# EAGLE board TD Toolboard V2 (EAGLE 9.6.2)
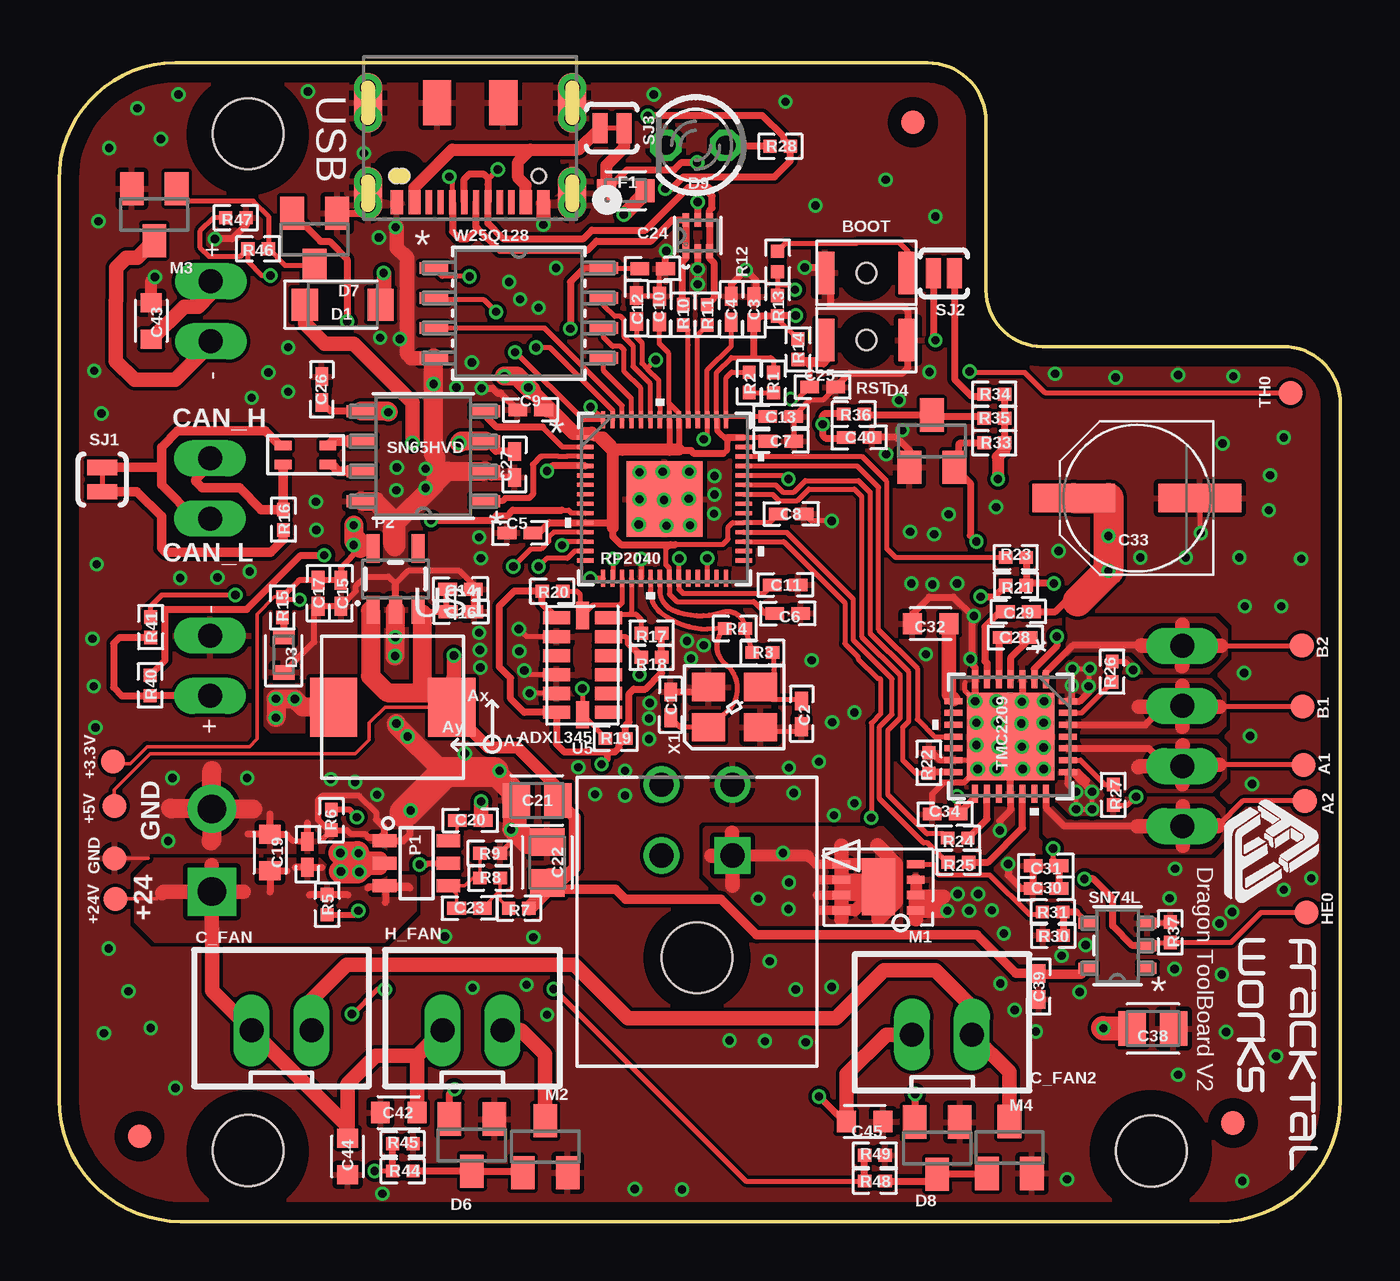
[diagram p2: board, top side]
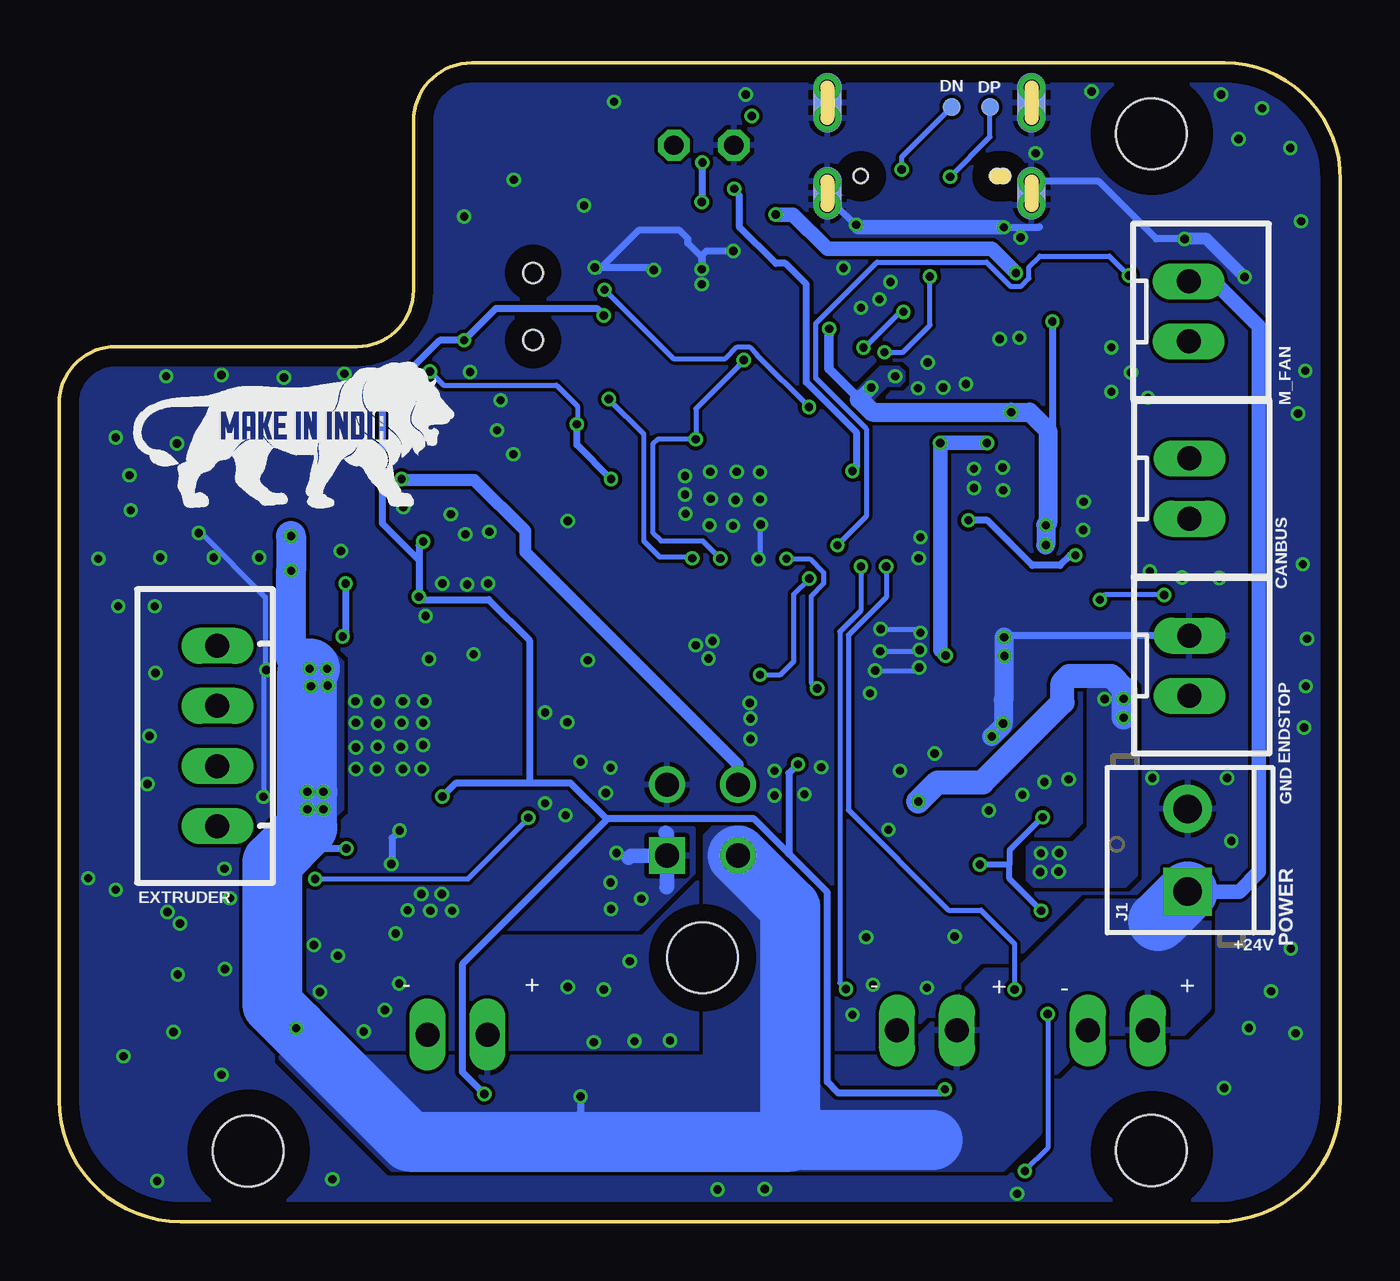
[diagram p3: board, bottom side, seen from below]

Size 54.2 x 49 mm. Coordinates in mm from the lower left corner, seen from the top.
Outline: 4.9,49 36.74,49 arc-90 39.21,46.53 39.21,39.38 arc90 41.59,37 51.8,37 arc-90 54.2,34.6 54.2,5.14 arc-90 49.06,0 5.15,0 arc-90 0,5.15 0,44.05 arc-90 4.9,49
Copper layers (1*16): Top 0.035mm / dielectric 1.5mm / Bottom 0.035mm
Design rules "LionCircuits *": minimum track width 6mil, minimum drill 0.35mm, track to track 6mil, track to pad 6mil, pad to pad 6mil, via to via 6mil, smd to smd 6mil, copper to edge 30mil, drill to drill 10mil, minimum pad ring 10mil, minimum via ring 5mil, stop-mask expansion 4mil, vias tented up to drill 0mil, thermal gap 8mil
Holes 3 mm at 8,46 8,3 46.2,2.99
tRestrict: area 5.5,43.5 to 10.5,48.5; area 43.7,0.5 to 48.7,5.5; area 5.5,0.5 to 10.5,5.5
bRestrict: area 5.5,43.5 to 10.5,48.5; area 5.5,0.4 to 10.5,5.4; area 43.7,0.5 to 48.7,5.5

## Footprints (pad centres in the part's own frame; a part is rotated, then mirrored left to right if it is on the bottom)
PAD.03X.04 = smd 1.016 x 1.016: P$1 0,0
B3U-1000P(M)-B = smd 0.8 x 1.8: 1 -1.75,0; 2 1.75,0 | hole 0.85: 0,0
CAPC1005X60 = smd 0.79 x 0.54: 1 -0.55,0; 2 0.545,0
CAPC1608X85 = smd 0.8 x 0.9: 1 -0.775,0; 2 0.775,0
CAPC2012X110 = smd 1.165 x 1.465: 1 -0.875,0; 2 0.875,0
PANASONIC_D = smd 3.5 x 1.2: + 2.67,0; - -2.67,0
JST-XH-02-PACKAGE-LONG-PAD = drill 1.016 long: 1 -1.27,0; 2 1.27,0
SODFL3718X115 = smd 1.115 x 1.361: 1 -1.6,0; 2 1.6,0
SOT-666_STM-L = smd 0.583 x 0.28: 1 -0.66,0.5; 2 -0.66,0; 3 -0.66,-0.5; 4 0.66,-0.5; 5 0.66,0; 6 0.66,0.5
LEDC1608X35N_FLAT-G = smd 0.612 x 0.912: A 0.75,0; C -0.75,0
SOT23 = smd 1 x 1.4: 1 -0.95,-1.1; 2 0.95,-1.1; 3 0,1.1
LED3MM = drill 0.813 octagon: A -1.27,0; K 1.27,0
JST-XH-04-PACKAGE-LONG-PAD = drill 1.016 long: 1 -3.81,0; 2 -1.27,0; 3 1.27,0; 4 3.81,0
FUSC1608X60N = smd 0.799 x 0.974: 1 -0.815,0; 2 0.815,0
FIDUCIAL_1MM = smd 1 x 1: 1 0,0
PAD.03X.03 = smd 0.762 x 0.762: P$1 0,0
SCREWTERMINAL-3.5MM-2 = drill 1.2 pad 2.032 square: 1 0,0 | drill 1.2 pad 2.032: 2 3.5,0
CON_430450400_MOL = drill 1.02 pad 1.52 square: 1 0,0 | drill 1.02 pad 1.52: 2 -3,0; 3 0,3; 4 -3,3 | hole 3: -1.5,-4.32
NMOSFET_WSD3066DN33 = smd 0.75 x 0.35: P$1 -1.575,1; P$2 -1.575,0.35; P$3 -1.575,-0.3; P$4 -1.575,-0.95; P$5 1.575,-0.95; P$6 1.575,-0.3; P$7 1.575,0.35; P$8 1.575,1 | smd 1.4 x 2.4: P$9 0,0
SOT-23-6 = smd 1 x 0.55: 1 -1.35,0.95; 2 -1.35,0; 3 -1.35,-0.95; 4 1.35,-0.95; 5 1.35,0; 6 1.35,0.95
SOT23-5 = smd 0.55 x 1.2: 1 -0.95,-1.3; 2 0,-1.3; 3 0.95,-1.3; 4 0.95,1.3; 5 -0.95,1.3
RESC1005X40 = smd 0.566 x 0.54: 1 -0.433,0; 2 0.433,0
SJ_2S-TRACE = smd 0.635 x 1.27: 1 -0.508,0; 2 0.508,0
SJ_2S-NO = smd 0.635 x 1.27: 1 -0.45,0; 2 0.45,0
IC57_RP2040-L = smd 0.708 x 0.179: 1 -3.351,2.6; 2 -3.351,2.2; 3 -3.351,1.8; 4 -3.351,1.4; 5 -3.351,1; 6 -3.351,0.6; 7 -3.351,0.2; 8 -3.351,-0.2; 9 -3.351,-0.6; 10 -3.351,-1; 11 -3.351,-1.4; 12 -3.351,-1.8; 13 -3.351,-2.2; 14 -3.351,-2.6; 29 3.351,-2.6; 30 3.351,-2.2; 31 3.351,-1.8; 32 3.351,-1.4; 33 3.351,-1; 34 3.351,-0.6; 35 3.351,-0.2; 36 3.351,0.2; 37 3.351,0.6; 38 3.351,1; 39 3.351,1.4; 40 3.351,1.8; 41 3.351,2.2; 42 3.351,2.6 | smd 0.179 x 0.708: 15 -2.6,-3.351; 16 -2.2,-3.351; 17 -1.8,-3.351; 18 -1.4,-3.351; 19 -1,-3.351; 20 -0.6,-3.351; 21 -0.2,-3.351; 22 0.2,-3.351; 23 0.6,-3.351; 24 1,-3.351; 25 1.4,-3.351; 26 1.8,-3.351; 27 2.2,-3.351; 28 2.6,-3.351; 43 2.6,3.351; 44 2.2,3.351; 45 1.8,3.351; 46 1.4,3.351; 47 1,3.351; 48 0.6,3.351; 49 0.2,3.351; 50 -0.2,3.351; 51 -0.6,3.351; 52 -1,3.351; 53 -1.4,3.351; 54 -1.8,3.351; 55 -2.2,3.351; 56 -2.6,3.351 | smd 3.2 x 3.2: 57 0,0
SOIC_128JVSIQ_WIN-L = smd 1.213 x 0.483: 1 -3.595,1.905; 2 -3.595,0.635; 3 -3.595,-0.635; 4 -3.595,-1.905; 5 3.595,-1.905; 6 3.595,-0.635; 7 3.595,0.635; 8 3.595,1.905
D8-L = smd 1.255 x 0.508: 1 -2.621,1.905; 2 -2.621,0.635; 3 -2.621,-0.635; 4 -2.621,-1.905; 5 2.621,-1.905; 6 2.621,-0.635; 7 2.621,0.635; 8 2.621,1.905
ADXL345_LGA14 = smd 1.145 x 0.55: 1 -1.097,2; 2 -1.097,1.2; 3 -1.097,0.4; 4 -1.097,-0.4; 5 -1.097,-1.2; 6 -1.097,-2; 8 1.097,-2; 9 1.097,-1.2; 10 1.097,-0.4; 11 1.097,0.4; 12 1.097,1.2; 13 1.097,2 | smd 0.55 x 1.145: 7 0,-2.098; 14 0,2.098
DBV5-L = smd 0.772 x 0.458: 1 -1.262,0.95; 2 -1.262,0; 3 -1.262,-0.95; 4 1.262,-0.95; 5 1.262,0.95
QFN28_5X5_3X8_EPAD_TRI = smd 0.757 x 0.255: 1 -2.423,1.5; 2 -2.423,1; 3 -2.423,0.5; 4 -2.423,0; 5 -2.423,-0.5; 6 -2.423,-1; 7 -2.423,-1.5; 15 2.423,-1.5; 16 2.423,-1; 17 2.423,-0.5; 18 2.423,0; 19 2.423,0.5; 20 2.423,1; 21 2.423,1.5 | smd 0.255 x 0.757: 8 -1.5,-2.423; 9 -1,-2.423; 10 -0.5,-2.423; 11 0,-2.423; 12 0.5,-2.423; 13 1,-2.423; 14 1.5,-2.423; 22 1.5,2.423; 23 1,2.423; 24 0.5,2.423; 25 0,2.423; 26 -0.5,2.423; 27 -1,2.423; 28 -1.5,2.423 | smd 3.7 x 3.7: 29 0,0
YSPI0530-150 = smd 2 x 2.5: 1 -2.5,0; 2 2.5,0
FDCW2012-2-201TF = smd 0.7 x 0.4: 1 -0.95,0.4; 2 -0.95,-0.4; 3 0.95,-0.4; 4 0.95,0.4
CONN12_KH-TYPE-C-16P = smd 0.52 x 1: 1 -3.1,1.1; 2 -2.35,1.1; 11 2.35,1.1; 12 3.1,1.1 | smd 0.27 x 1: 3 -1.75,1.1; 4 -1.25,1.1; 5 -0.75,1.1; 6 -0.25,1.1; 7 0.25,1.1; 8 0.75,1.1; 9 1.25,1.1; 10 1.75,1.1 | smd 1.2 x 2.2: 13 -4.32,0.725; 14 4.32,0.725 | smd 1.2 x 2.5: 15 -4.32,-3.1; 16 4.32,-3.1 | smd 1.2 x 1.9: 18 -1.4,-3.1; 19 1.4,-3.1 | drill 0.65 pad 0.65: 20 -4.32,1.225; 21 -4.32,0.225; 24 4.32,1.225; 25 4.32,0.225; 26 4.32,-2.45; 27 4.32,-3.75; 28 -4.32,-2.45; 29 -4.32,-3.75 | smd 1.2 x 2.5 bottom: 37 -4.32,-3.1; 41 4.32,-3.1 | smd 1.2 x 2.2 bottom: 39 -4.32,0.725; 43 4.32,0.725 | hole 0.6: -2.9,0; 3.125,0; 2.875,0
CRYSTAL_3225 = smd 1.4 x 1.2: P$1 -1.1,-0.85; P$2 1.1,-0.85; P$3 1.1,0.85; P$4 -1.1,0.85

## Placement (x,y rotation side)
3.3V  TEST-POINT3X4  [PAD.03X.04]  2.29,19.45 90 top
5V  TEST-POINT3X4  [PAD.03X.04]  2.34,17.58 90 top
24V  TEST-POINT3X4  [PAD.03X.04]  2.37,13.65 90 top
A1  TEST-POINT3X4  [PAD.03X.04]  52.64,19.31 90 top
A2  TEST-POINT3X4  [PAD.03X.04]  52.69,17.79 90 top
B1  TEST-POINT3X4  [PAD.03X.04]  52.59,21.78 90 top
B2  TEST-POINT3X4  [PAD.03X.04]  52.57,24.37 90 top
BOOT  B3U-1000P(M)-B  [B3U-1000P(M)-B]  34.15,40.12 0 top
C1  30pF  [CAPC1005X60]  25.87,21.85 90 top
C2  30pF  [CAPC1005X60]  31.41,21.47 90 top
C3  1uF  [CAPC1005X60]  29.4,38.57 90 top
C4  1uF  [CAPC1005X60]  28.44,38.58 90 top
C5  100nF  [CAPC1005X60]  19.49,29.12 180 top
C6  100nF  [CAPC1005X60]  30.82,25.71 0 top
C7  100nF  [CAPC1005X60]  30.53,33 0 top
C8  100nF  [CAPC1005X60]  30.97,29.92 0 top
C9  100nF  [CAPC1005X60]  19.94,34.32 180 top
C10  100nF  [CAPC1005X60]  25.39,38.59 90 top
C11  100nF  [CAPC1005X60]  30.72,26.92 0 top
C12  100nF  [CAPC1005X60]  24.42,38.61 90 top
C13  1uF  [CAPC1005X60]  30.53,34.04 0 top
C14  1uF  [CAPC1005X60]  16.98,26.74 0 top
C15  1uF  [CAPC1005X60]  11.92,26.57 270 top
C16  100nF  [CAPC1005X60]  17,25.79 0 top
C17  100nF  [CAPC1005X60]  10.96,26.57 270 top
C18  100nF  [CAPC1005X60]  10.5,15.53 90 top
C19  10uF  [CAPC1608X85]  8.92,15.6 90 top
C20  100nF  [CAPC1005X60]  17.39,16.96 0 top
C21  22uF  [CAPC2012X110]  20.21,17.81 180 top
C22  22uF  [CAPC2012X110]  20.65,15.18 90 top
C23  75pF  [CAPC1005X60]  17.36,13.25 180 top
C24  100nF  [CAPC1005X60]  25.11,40.29 0 top
C25  100nF  [CAPC1005X60]  32.3,35.29 180 top
C26  100nF  [CAPC1005X60]  11.11,35.19 90 top
C27  100nF  [CAPC1005X60]  19.27,32.01 270 top
C28  22nF  [CAPC1005X60]  40.45,24.7 0 top
C29  100nF  [CAPC1005X60]  40.58,25.79 180 top
C30  100nF  [CAPC1005X60]  41.75,14.08 0 top
C31  100nF  [CAPC1005X60]  41.75,15.05 0 top
C32  4.7uF  [CAPC1608X85]  36.87,25.28 0 top
C33  100uF  [PANASONIC_D]  45.58,30.59 180 top
C34  100nF  [CAPC1005X60]  37.48,17.23 180 top
C38  22uF  [CAPC2012X110]  46.27,8.16 0 top
C39  100nF  [CAPC1005X60]  41.44,9.94 270 top
C40  100nF  [CAPC1005X60]  33.85,33.16 0 top
C42  4.7uF  [CAPC1608X85]  14.36,4.61 180 top
C43  4.7uF  [CAPC1608X85]  3.9,38.08 90 top
C44  4.7uF  [CAPC1608X85]  12.21,2.75 270 top
C45  4.7uF  [CAPC1608X85]  34.08,4.23 0 top
C_FAN  JST-XH-02-PIN-LONG-PAD  [JST-XH-02-PACKAGE-LONG-PAD]  9.41,8.09 0 top
C_FAN2  JST-XH  [JST-XH-02-PACKAGE-LONG-PAD]  37.35,7.91 0 top
CANBUS  JST-XH-02-PIN-LONG-PAD  [JST-XH-02-PACKAGE-LONG-PAD]  6.39,31 270 bottom
D1  MBR0520LT1G  [SODFL3718X115]  12,38.77 0 top
D2  USBLC6-2P6SOT-666_STM-L  [SOT-666_STM-L]  27.01,41.69 90 top
D3  LED_G  [LEDC1608X35N_FLAT-G]  9.5,23.97 90 top
D4  BAT54S  [SOT23]  36.92,33 0 top
D6  BAT54S  [SOT23]  17.46,3.24 180 top
D7  BAT54S  [SOT23]  10.81,41.54 180 top
D8  BAT54S  [SOT23]  37.15,3.11 180 top
D9  LED_G  [LED3MM]  26.93,45.51 180 top
ENDSTOP  JST-XH-02-PIN-LONG-PAD  [JST-XH-02-PACKAGE-LONG-PAD]  6.39,23.5 270 bottom
EXTRUDER  JST-XH-04-PIN-LONG-PAD  [JST-XH-04-PACKAGE-LONG-PAD]  47.51,20.53 90 bottom
F1  FUSE_CHIP-0603(1608-METRIC)  [FUSC1608X60N]  23.97,43.6 180 top
FD4  FIDUCIAL  [FIDUCIAL_1MM]  49.66,4.17 0 top
FD5  FIDUCIAL  [FIDUCIAL_1MM]  3.4,3.61 0 top
FD6  FIDUCIAL  [FIDUCIAL_1MM]  36.12,46.48 0 top
GND  TEST-POINT3X4  [PAD.03X.04]  2.34,15.35 0 top
H_FAN  JST-XH-02-PIN-LONG-PAD  [JST-XH-02-PACKAGE-LONG-PAD]  17.49,8.09 0 top
HE0  TEST-POINT3X4  [PAD.03X.04]  52.77,13.07 0 top
IO1  TEST-POINT3  [PAD.03X.03]  16.45,47.13 0 bottom
IO2  TEST-POINT3  [PAD.03X.03]  14.82,47.13 0 bottom
J1  [SCREWTERMINAL-3.5MM-2]  6.46,13.95 90 bottom
J3  JST-MICROFIT  [CON_430450400_MOL]  28.49,15.48 0 top
M1  NMOSFET_WSD3066DN33  [NMOSFET_WSD3066DN33]  34.66,14.16 180 top
M2  CJ3400  [SOT23]  20.56,3.16 0 top
M3  CJ3400  [SOT23]  4.03,42.58 180 top
M4  CJ3400  [SOT23]  40.2,3.13 0 top
M_FAN  JST-XH-02-PIN-LONG-PAD  [JST-XH-02-PACKAGE-LONG-PAD]  6.41,38.49 270 bottom
P1  TPS54202_BUCKCONV  [SOT-23-6]  15.12,15.15 0 top
P2  3.3V  [SOT23-5]  14.23,27.17 0 top
R1  200R  [RESC1005X40]  30.22,35.48 90 top
R2  1R  [RESC1005X40]  29.19,35.48 270 top
R3  1K  [RESC1005X40]  29.76,24.06 180 top
R4  NO-FIT  [RESC1005X40]  28.59,25.08 180 top
R5  511k  [RESC1005X40]  11.34,13.41 90 top
R6  105k  [RESC1005X40]  11.52,16.98 90 top
R7  49.9R  [RESC1005X40]  19.44,13.25 0 top
R8  100k  [RESC1005X40]  18.23,14.52 0 top
R9  13.3k  [RESC1005X40]  18.22,15.58 180 top
R10  27.4R  [RESC1005X40]  26.4,38.34 270 top
R11  27.4R  [RESC1005X40]  27.42,38.34 270 top
R12  1K  [RESC1005X40]  30.39,40.6 90 top
R13  DO NOT FIT (10K)  [RESC1005X40]  30.39,38.72 270 top
R14  100k  [RESC1005X40]  31.26,36.89 90 top
R15  49.9R  [RESC1005X40]  9.44,25.98 90 top
R16  120R  [RESC1005X40]  9.49,29.68 270 top
R17  4.7K  [RESC1005X40]  25.06,24.88 0 top
R18  4.7K  [RESC1005X40]  25.06,23.86 0 top
R19  4.7K  [RESC1005X40]  23.53,20.43 0 top
R20  4.7K  [RESC1005X40]  20.87,26.65 180 top
R21  10K  [RESC1005X40]  40.48,26.91 0 top
R22  10K  [RESC1005X40]  36.79,19.39 270 top
R23  1K  [RESC1005X40]  40.48,28.08 180 top
R24  1K  [RESC1005X40]  38.01,16.21 0 top
R25  1K  [RESC1005X40]  38.04,15.2 0 top
R26  220mΩ  [RESC1005X40]  44.54,23.25 270 top
R27  220mΩ  [RESC1005X40]  44.59,18.04 90 top
R28  49.9R  [RESC1005X40]  30.5,45.47 0 top
R30  20K  [RESC1005X40]  42.05,12.1 0 top
R31  27.4R  [RESC1005X40]  42.03,13.09 0 top
R33  4.7K  [RESC1005X40]  39.56,32.93 180 top
R34  4.12K  [RESC1005X40]  39.56,34.99 180 top
R35  2.37K  [RESC1005X40]  39.56,33.97 180 top
R36  2.37K  [RESC1005X40]  33.62,34.15 180 top
R37  10K  [RESC1005X40]  47,12.23 270 top
R40  1K  [RESC1005X40]  3.85,22.67 270 top
R41  10K  [RESC1005X40]  3.87,25.13 270 top
R44  27.4R  [RESC1005X40]  14.54,2.14 180 top
R45  20K  [RESC1005X40]  14.54,3.29 180 top
R46  27.4R  [RESC1005X40]  8.42,41.13 180 top
R47  20K  [RESC1005X40]  7.48,42.45 180 top
R48  27.4R  [RESC1005X40]  34.51,1.71 180 top
R49  20K  [RESC1005X40]  34.51,2.8 180 top
RST  B3U-1000P(M)-B  [B3U-1000P(M)-B]  34.15,37.27 180 top
SJ1  SOLDERJUMPERTRACE  [SJ_2S-TRACE]  1.82,31.38 270 top
SJ2  SOLDERJUMPERNO  [SJ_2S-NO]  37.43,40.09 180 top
SJ3  SOLDERJUMPERTRACE  [SJ_2S-TRACE]  23.38,46.24 180 top
TH0  TEST-POINT3X4  [PAD.03X.04]  52.08,35.04 0 top
U1  RP2040  [IC57_RP2040-L]  25.61,30.55 0 top
U2  W25Q128  [SOIC_128JVSIQ_WIN-L]  19.44,38.41 0 top
U3  SN65HVD  [D8-L]  15.41,32.37 180 top
U5  ADXL345  [ADXL345_LGA14]  22.14,23.53 0 top
U6  SN74L  [DBV5-L]  44.77,11.67 180 top
U7  TMC2209  [QFN28_5X5_3X8_EPAD_TRI]  40.25,20.51 270 top
U$1  YSPI0530-150  [YSPI0530-150]  14.11,21.75 0 top
U$2  [MAKEININDIA]  50.08,29.47 0 bottom
U$3  [FWLOGO_SMALL]  48.15,18.04 270 top
U$4  FDCW2012-2-201TF  [FDCW2012-2-201TF]  10.43,32.42 180 top
USB  USB-C(KH-TYPE-C-16P)  [CONN12_KH-TYPE-C-16P]  17.39,44.21 180 top
X1  CRYSTAL_TAXM12M4RLBDDT2T_3225  [CRYSTAL_3225]  28.56,21.75 0 top

## Tracks (layer width: path | path; a pad name or v marks a point on that pad's centre or on a via)
+1.1V  (via drill 0.35)
  Top 0.203: U1.50 25.41,34.48 25.37,34.52 25.37,35.57 24.87,36.07 | C12.1 24.42,37.39 24.65,37.16 24.65,36.29 24.87,36.07 | C4.1 28.44,37.03 27.41,36.01 U1.45 27.41,33.23 v27.27,33.08 | v26.23,28.03 26.21,28.02 U1.23 26.22,26.73 26.38,26.57 29.82,26.57 C11.1 | 24.87,36.07 v25.24,36.43
  Bottom 0.203: v25.24,36.43 25.24,36.41 27.27,34.38 v27.27,33.08 28.89,33.08 29.07,32.9 29.07,29.11 28.74,28.78 26.98,28.78 v26.23,28.03
+3.3V  (via drill 0.35)
  Top 0.152: 3.3V.P$1 2.37,19.36 3,19.36 3.72,20.08 8.06,20.08 8.39,20.41 8.39,25.69 9.11,26.41 R15.2
  Top 0.203: C24.1 23.06,40.29 U2.8 | C7.1 29.83,33.15 U1.42 | C8.1 30.05,29.55 U1.33 28.49,29.55 28.3,29.37 28.3,28.86 28.08,28.64 28.07,28.65 26.09,28.65 26.07,28.63 | U1.49 25.79,33.92 25.79,34.6 | U1.44 27.81,35.91 28.44,36.53 29.4,36.53 30.11,36.53 30.22,36.43 R1.2 | C10.1 25.39,37.12 25.79,36.71 25.79,34.6 | U1.48 26.21,34.18 25.79,34.6 | 25.86,28.63 25.66,28.42 25.66,27.79 25.81,27.63 U1.22 25.81,26.53 26.13,26.21 29.38,26.21 29.83,25.76 29.83,25.71 C6.1 | R13.2 30.39,38.19 R14.2 | U1.1 22.88,33.15 22.89,33.14 | 22.9,33.14 22.9,33.13 23.38,32.65 | R41.1 3.87,26.02 4.35,26.5 v7.46,26.5 | v10.17,26.3 9.55,26.3 R15.2
  Top 0.254: P2.5 12.74,28.47 11.92,27.65 C15.1 C17.1 10.15,27.12 R15.2 | 28.09,32.47 28.26,32.64 28.26,33.15 | 23.82,32.5 23.08,33.24 | U1.44 27.83,33.88 27.83,33.45 28.29,32.99 28.29,33.15 | U1.49 25.81,32.57 | U1.48 26.21,32.65 26.21,32.51
  Top 0.305: U3.5 11.48,34.27 C26.1 | U2.8 22.21,40.32 21.63,39.74 v21.63,37.75 | C5.1 20.29,29.12 20.73,29.55 U1.10 23.23,29.55 23.42,29.36 23.42,28.97 23.76,28.63 25.86,28.63 26.07,28.63 | U7.15 38.75,17.95 C34.1 38.03,17.97 v37.99,17.97 | 23.42,32.62 23.42,32.9 23.08,33.24 22.8,33.24 22.78,33.26 21.96,33.26 | 28.09,32.47 26.86,32.47 26.73,32.6 25.84,32.6 | 23.18,19.86 21.37,19.86 21.04,20.18 U5.6 19.68,21.53 19.1,22.11 19.1,22.97 18.63,23.44 18.63,26.03 19.26,26.65 R20.2 20.43,26.14 U5.1 | 23.18,19.86 23.51,19.86 23.69,20.03 23.69,20.15 R19.2 23.97,20.98 24.11,21.13 24.11,22.33 24.3,22.52 24.8,22.52 25.49,23.21 R18.2 R17.2 | v22.95,19.34 23.18,19.57 23.18,19.86 | v38.98,26.43 39.56,26.43 R21.1 | v31.15,38.31 30.42,38.31 R13.2 29.66,38.29 C3.1 29.4,36.53 | SJ2.2 36.98,37.36 v37.07,37.26 | R33.2 38.11,32.93 38.06,32.88 38.06,32.1 D4.2 38.55,31.23 38.55,29.02 v38.8,28.76 | D7.2 11.05,41.44 11.43,41.44 12.18,40.7 v12.18,38.06 | v36.21,5.39 36.2,5.38 D8.2 | D6.2 16.51,5.38 v16.73,5.6 | 28.26,33.15 28.29,33.15 U1.42
  Top 0.406: P2.5 12.46,29.29 v12.46,29.45 | 19.97,35.15 20.79,34.32 20.9,34.32 21.96,33.26 21.88,33.26 20.94,34.2 20.61,34.2 C9.1 | 25.84,32.6 25.81,32.57
  Top 0.508: 21.93,33.36 22.54,33.36 22.65,33.25 | 26.21,32.65 23.38,32.65 22.89,33.14 22.9,33.14 23.42,32.62 23.42,29.36
  Top 0.61: v19.85,35.26 21.75,33.36 21.93,33.36
  Top 0.813: v13.93,34.22 13.88,34.27 U3.5 | v12.46,29.45 12.46,28.75 12.74,28.47 | v18.83,35.75 19.37,35.75 v19.85,35.26 19.97,35.15
  Bottom 0.203: v7.46,26.5 9.97,26.5 v10.17,26.3
  Bottom 0.254: 37.41,18.56 34.31,18.56
  Bottom 0.305: v22.95,19.34 23.33,18.96 23.33,15.55 | 31.03,17 30.98,17.05 24.83,17.05 23.33,15.55 | 34.31,18.56 34.31,24.58 36.03,26.3 38.85,26.3 v38.98,26.43 38.98,27.97 | 38.98,27.97 40.53,29.52 40.53,34.83 38.09,37.26 v37.07,37.26 35.73,38.61 31.45,38.61 v31.15,38.31 | 38.98,27.97 38.98,28.58 v38.8,28.76 | v12.18,38.06 12.18,33.66 12.38,33.46 | v37.99,17.97 37.41,18.56 32.58,18.56 31.03,17 | v36.21,5.39 37.15,6.33 37.15,10.88 31.03,17 | v16.73,5.6 16.88,5.45 21.25,5.45 21.7,5.9 21.7,13.92 23.33,15.55
  Bottom 0.406: v21.63,37.75 21.63,36.05 20.35,34.77
  Bottom 0.61: 20.35,34.77 v19.85,35.26
  Bottom 0.813: v12.46,28.61 v12.46,29.45 12.38,29.52 12.38,33.46 13.15,34.22 v13.93,34.22 19.8,34.22 20.35,34.77
  pour Bottom: 18.71,36.15 19.47,36.15 20.49,35.14 19.98,34.63 19.93,34.63 19.88,34.63 19.17,35.34 18.63,35.34 18.45,35.52 18.43,35.54 18.43,35.93 18.66,36.15
+5V  (via drill 0.35)
  Top 0.152: 5V.P$1 2.34,18.27 3.84,19.77 12.51,19.77 13.12,20.38 13.12,21.09 13.78,21.75 U$1.2
  Top 0.203: P2.3 15.36,25.69
  Top 0.254: 15.26,25.79 C16.1 16.37,25.87 16.37,26.67 C14.1 | P2.1 13.25,25.84 13.18,25.84
  Top 0.305: C27.1 18.47,32.56 U3.3 | P2.3 15.26,25.79
  Top 0.406: U6.5 43.25,10.46 41.47,10.46 C39.1 40.46,10.49 38.83,12.13 29.51,12.13 28.01,13.62 23.97,13.62 23.53,14.06 20.68,14.06 20.65,14.02
  Top 0.508: 20.78,14.44 21.27,14.44 21.81,14.97 21.81,17.09 C21.1 21.09,18.34 19.37,20.05 18.15,20.05 16.61,21.59 | U$1.2 16.61,22.36 16.61,22.96 16.7,23.05
  Top 0.61: R7.2 20.65,14.02 C22.1 | 15.36,22.59 15.13,22.36 15.1,22.34 | v16.7,23.94 16.7,23.05 16.7,22.74 | v14.95,32.93 14.95,34.63 12.46,37.12 11.24,37.12 10.4,37.96 D1.1
  Top 0.813: 13.18,25.84 13.18,23.07 13.88,22.36 15.13,22.36 16.61,22.36 | 15.36,25.69 15.36,22.59 | U3.3 17.01,33 v16.93,32.93 | U$1.2 16.61,21.59 | 16.61,22.65 16.7,22.74
  Top 1.016: 20.78,14.44 C22.1
  Bottom 0.61: v16.7,23.94 16.93,24.16 v16.93,32.93 v14.95,32.93
+24V  (via drill 0.35)
  Top 0.152: 24V.P$1 4.12,13.65 4.35,13.88
  Top 0.203: v43.02,18.17 v43.02,17.43 v43.7,17.43 v43.7,18.17 | v43.55,22.64 43.55,23.33 v43.6,23.38 v42.86,23.38 42.86,22.69 v42.84,22.67 | 42.05,15.29 v42.05,15.77
  Top 0.305: P1.3 14.75,14.2 14.84,14.11 13.85,14.11 P1.3 | P1.3 13.8,14.16 13.8,13.48 | P1.3 13.72,14.15 13.1,14.15 13.06,14.1 | 12.21,13.81 12.18,13.84 R5.2 11.32,13.82 10.59,13.82 | 10,14.98 C18.1 11.12,14.98 | C19.1 8.89,14.79 | C19.1 8.92,13.93 | C19.1 9.64,14.83 | v43.55,22.64 43.55,22.38 43.18,22.01 U7.28 42.84,22.17 v42.84,22.67 | 43.46,18.65 43.1,19.01 42.91,19.01 | 42.91,19.01 U7.22 42.67,18.52 v43.02,18.17 | v43.7,18.17 42.91,18.96 42.91,19.01 | C45.1 33.21,4.23 v32.14,5.29 | C29.1 42.15,25.79 43.09,26.73 | 43.09,26.22 43.09,26.73 | v44.39,28.99 44.39,28.03 43.09,26.73 | 42.05,15.29 C31.2 C30.2
  Top 0.61: J1.1 6.46,15.08 | J1.1 7.81,13.95 | J1.1 6.46,12.37 6.47,12.36 6.47,9.75 C_FAN.1 12.21,4.02 C44.1 12.21,5.83 13.39,7.01 15.14,7.01 | J1.1 4.42,13.95 4.35,13.88 | C43.1 5.28,38.69 5.88,38.69 6.41,39.23 M_FAN.1 | C45.1 33.3,6.22 34.99,7.91 C_FAN2.1 | C42.1 15.14,7.01 | 15.14,7.01 H_FAN.1
  Top 1.016: C38.1 44.18,8.16 v44.17,8.18
  Top 1.27: C33.+ 44.39,30.59 v44.39,28.99 v44.39,27.52 43.09,26.22
  Bottom 0.203: 43.26,15.77 43.6,15.43 43.7,15.53 v43.7,17.43
  Bottom 0.305: v32.14,5.29 32.14,3.38 | v42.05,15.77 43.26,15.77 | v43.6,23.38 43.94,23.38 44.39,23.83
  Bottom 0.61: J1.1 4.28,13.95 3.44,14.79 3.44,37.86 5.35,39.76 M_FAN.1
  Bottom 1.27: v44.39,28.99 v44.39,27.52 44.39,23.83
  Bottom 2.54: J3.2 23.28,13.27 23.28,3.38 32.14,3.38 39.37,3.38 v44.17,8.18 45.17,9.18 45.17,15.2 43.7,16.67 v43.7,18.17 43.7,23.28 v43.6,23.38 | 22.67,3.45 17.25,3.45 | J1.1 7.71,12.71
  pour Top: 4.02,15.36 11.02,15.36 11.34,15.05 11.34,14.3 11.46,14.17 12.91,14.17 13.27,14.53 13.28,14.53 13.4,14.65 15.02,14.65 15.09,14.58 15.09,13.13 13.78,11.82 4.06,11.82 3.22,12.65 3.22,14.56
  pour Bottom: 42.76,24.27 42.18,23.68 42.18,17.43 42.84,16.77 43.96,16.77 44.46,17.28 44.46,23.76 43.96,24.27
  pour Top (rank 2): 42.71,24.19 42.2,23.68 42.2,22.01 42.28,21.93 43.57,21.93 44.29,22.64 44.29,24.19
  pour Top (rank 2): 42.36,19.09 43.78,19.09 44.46,18.4 44.46,17.1 44.18,16.82 42.58,16.82 42.18,17.23 42.18,18.91
  pour Bottom: 5.58,13.57 5.58,9 6.64,7.93 10.4,7.93 12.74,5.6 12.74,3.74 14.29,2.19 40.09,2.19 44.82,6.92 44.82,6.97 18.66,6.97 14.97,10.65 13.63,10.65 10.71,13.57
  pour Bottom: 22.01,7.22 22.01,13.57 22.19,13.75 25.16,16.72 26.56,16.72 26.94,16.34 26.94,6.92 22.01,6.92
A1
  Top 0.203: A1.P$1 49.09,19.31
  Top 0.305: U7.24 46.11,20.01 46.88,19.24 47.49,19.24 EXTRUDER.2
  Top 0.61: EXTRUDER.2 45.71,19.26 45.66,19.21 | EXTRUDER.2 47.51,20.13 47.54,20.15 | EXTRUDER.2 47.56,19.31 49.09,19.31 | EXTRUDER.2 47.51,18.5
  pour Top: 42.61,20.38 42.61,19.75 42.63,19.72 43.4,19.72 44.95,18.17 48.78,18.17 49.37,18.75 49.37,20.02 49.01,20.38
A2
  Top 0.203: A2.P$1 50.08,17.79 49.01,16.72
  Top 0.305: U7.21 41.75,17.51 42.53,16.72 45.61,16.72
  Top 0.61: EXTRUDER.1 45.61,16.72 | EXTRUDER.1 49.01,16.72 49.04,16.75 | EXTRUDER.1 47.54,16.75 47.54,17.56 | EXTRUDER.1 47.54,16.7 47.54,15.88
  pour Top: 41.64,17.89 41.64,16.39 42.46,15.58 48.73,15.58 49.32,16.16 49.32,17.46 48.85,17.93 45.95,17.93 44.97,16.95 42.63,16.95 42,17.59 42,17.89
ADC_AVDD
  Top 0.203: R2.1 28.45,35.92 28.21,35.68 U1.43 28.21,34.04 C13.1
ADC_R
  Top 0.203: R2.2 R1.1
B1
  Top 0.203: B1.P$1 49.09,21.78
  Top 0.305: U7.26 45.95,21.01 46.75,21.8 EXTRUDER.3
  Top 0.61: EXTRUDER.3 47.51,22.67 | EXTRUDER.3 47.49,21.78 45.68,21.78 | EXTRUDER.3 47.51,20.91 | EXTRUDER.3 47.54,21.78 49.09,21.78
  pour Top: 42.63,21.24 43.35,21.24 45.05,22.95 48.73,22.95 49.34,22.34 49.34,20.96 49.01,20.63 42.63,20.63
B2
  Top 0.203: 49.14,24.34 52.54,24.34 B2.P$1
  Top 0.305: U7.1 41.75,23.23 42.89,24.37 45.78,24.37
  Top 0.61: EXTRUDER.4 47.51,25.23 | EXTRUDER.4 47.51,23.5 47.49,23.48 | EXTRUDER.4 45.81,24.34 45.78,24.37 | EXTRUDER.4 49.14,24.34
  pour Top: 42.63,23.91 42.63,25.56 48.88,25.56 49.39,25.05 49.39,23.94 48.63,23.17 46.32,23.17 45.4,24.09 42.81,24.09
BCBOOT
  Top 0.152: C20.1 16.84,16.47 P1.6
BRA
  Top 0.203: U7.23 43.2,19.51 44.23,18.48 R27.2
BRB
  Top 0.203: U7.27 43.25,21.51 44.54,22.79 R26.2
CAN1_N
  Top 0.406: U$4.2 11.56,33 U3.6
CAN1_P
  Top 0.305: 11.53,32.02 U$4.1
  Top 0.406: 11.53,32.02 11.81,31.73 U3.7
CAN_N
  Top 0.305: U$4.3 9.33,32.82
  Top 0.406: 4.33,31.89 SJ1.1 | 6.39,29.8 CANBUS.2 5.75,29.73 4.33,31.15 4.33,31.89 | 4.33,31.89 4.33,32.75 5.02,33.44 8.71,33.44 9.33,32.82
CAN_P
  Top 0.305: 9.48,30.22 9.49,30.21
  Top 0.406: CANBUS.1 6.39,31.99 5.78,31.38 5.78,31.3 6.06,31.02 7.63,31.02 8.55,30.11 R16.1 9.49,30.21 | U$4.4 9.48,30.22
CAN_RX
  Top 0.203: 20.45,33.59 21.29,32.75 U1.2
  Top 0.254: U3.4 18.03,34.07
  Top 0.305: 18.03,34.07 18.51,33.59 20.45,33.59
CAN_TX
  Top 0.203: U1.3 21.47,32.35 21.46,32.35 21.12,32.35 20.39,32.35
  Top 0.254: U3.1 18.76,30.46 18.89,30.59 19.88,30.59 20.04,30.75 20.04,32 20.39,32.35
CNT
  Top 0.406: SJ1.2 3.29,30.87 4.33,29.83 4.33,28.48 4.51,28.31 8.95,28.31 9.49,28.84 R16.2
DIR
  Top 0.305: R25.2 39.31,15.2 40.75,16.65 U7.19
E0_DIAG
  Top 0.203: U7.11 37.02,20.51 36.3,21.23 36.3,23.39 34.66,25.03 34.66,31.05 33.75,31.95 U1.39
E0_DIR
  Top 0.203: R25.1 37.55,15.2 36.74,16.01 36.57,16.01 34.71,17.87 34.71,20.93 35.23,21.45 35.23,22.95 33.59,24.59 33.59,26.32 30.77,29.15 28.96,29.15 U1.32
E0_EN
  Top 0.203: R23.2 35.4,28.08 35.01,28.46 35.01,31.3 33.96,32.35 U1.40
E0_STEP
  Top 0.203: R24.1 37.4,16.39 36.72,16.39 35.07,18.04 35.07,20.78 35.59,21.3 35.59,23.1 33.95,24.73 33.95,30.67 33.64,30.97 31.71,30.97 31.23,30.48 30.45,30.48 30.18,30.75 U1.36
E0_UART
  Top 0.203: U1.37 30.31,31.15 30.62,30.84 31.08,30.84 31.57,31.33 33.82,31.33 34.3,30.85 34.3,24.88 35.94,23.24 35.94,21.15 35.68,20.9 35.68,19.51 36.24,18.96 R22.2
  Top 0.305: U7.14 | U7.14 36.84,19.01 R22.2
ENDSTOP_X  (via drill 0.35)
  Top 0.203: 21.27,30.08 21.55,30.08 21.68,29.96 U1.9 | U1.9 | U1.9
  Top 0.305: R40.1 4.48,23.73 4.48,25.89 7.94,25.89 10.22,28.17 v11.21,28.17 v11.21,28.18 | v15.74,29.65 18.3,29.65 18.5,29.85 18.96,29.85 19.19,30.08 21.27,30.08
  Bottom 0.305: v11.21,28.18 11.43,28.18 11.86,27.75 13.03,27.75 14.94,29.65 v15.74,29.65
EX
  Top 0.305: ENDSTOP.2 R40.2 2.66,22.23 2.3,22.59 2.3,24.44 2.55,24.7 R41.2
FAN0  (via drill 0.35)
  Top 0.203: U1.11 20.93,29.15 20.71,28.94 20.71,28.76 20.38,28.43 19.95,28.43 v19.21,27.7 | v13.78,9.81 13.45,9.81 12.41,8.77 v12.38,8.77 | v13.35,2.14 R44.2
  Top 0.305: R44.2 14.08,2.17 14.08,3.26 R45.2
  Bottom 0.203: v19.21,27.7 19.21,26.4 20.82,24.8 20.82,17.41 16.57,13.17 15.2,13.17 13.78,11.74 v13.78,9.81 | v12.38,8.77 12.38,3.11 v13.35,2.14
FAN0G
  Top 0.305: 19.54,2.14 D6.3 R44.1
  Top 0.61: 19.54,2.14 M2.1
FAN1  (via drill 0.35)
  Top 0.203: U1.12 21.43,28.75 v21.27,28.6 | v8.94,40 8.59,40 7.99,40.6 R46.2 7.66,40.8 6.36,40.8 5.96,41.21 5.96,41.87 6.54,42.45 R47.2
  Bottom 0.203: v21.27,28.6 20.05,29.82 20.05,33.52 22.18,35.66 22.18,37.98 19.6,40.57 14.97,40.57 13.96,39.56 13.5,39.56 13.17,39.88 13.17,40.37 12.71,40.83 9.77,40.83 v8.94,40
FAN1G
  Top 0.203: M3.1 5.51,43.15 8.21,43.15 8.85,42.5 R46.1 9.55,40.44 D7.3
FAN2  (via drill 0.35)
  Top 0.203: U1.13 21.81,28.35 21.5,28.04 20.63,28.04 v20.28,27.7 | v20.92,9.84 29.05,1.71 R48.2
  Top 0.305: R48.2 R49.2
  Bottom 0.203: v20.28,27.7 20.28,25.84 21.17,24.95 21.17,10.09 v20.92,9.84
FAN2G
  Top 0.305: M4.1 39.22,2.01 D8.3 36.85,1.71 R48.1
GND  (via drill 0.35)
  Top 0.152: GND.P$1 3.76,15.35 | R9.1 18.78,15.58
  Top 0.203: 27.26,22.4 X1.P$4 | X1.P$2 29.85,20.72 31.2,20.72 C2.1 | BOOT.1 32.63,39.89 | 32.63,38.74 32.65,38.72 | C24.2 25.39,40.03 C10.2 25.37,39.16 C12.2 | C25.1 32.85,35.26 32.33,34.74 31.78,34.74 C13.2 C7.2 | 38.88,19.51 U7.13 | v32.68,29.63 31.81,29.63 C8.2 | R27.1 45.2,17.61 v45.56,17.97 | R26.1 45.07,23.68 v45.43,23.33 | v48.3,29.12 48.25,29.17 C33.- | U1.19 24.64,27.23 24.64,27.99 v24.61,28.01 | U5.5 v19.91,22.33 v19.9,22.34 | U5.4 19.84,23.13 v19.67,23.3 | U5.2 19.77,24.73 v19.44,25.05 | R37.1 46.96,12.62 U6.3 | R9.1 19.14,16.06 19.82,16.06 | U7.29 38.32,22.44 38.32,22.79
  Top 0.254: 11.07,16.1 11.48,16.51 11.43,16.51 | 9.88,16.1 9.67,16.31 | 10.14,16.07 C18.2 | 13.42,16.99 13.42,17.28 12.7,18 11.12,18 10.94,17.82 10.94,17 11.46,16.49 R6.1 12.18,16.55 12.34,16.39 12.94,16.39 13.08,16.25 13.61,16.25 P1.1 | D3.C 10.79,24.51 10.79,25.85 C17.2 C15.2 12.55,26.66 12.55,26.87 12.96,27.28 13.92,27.28 14.23,26.97 14.77,27.51 16.94,27.51 17.53,26.93 C14.2 17.55,26.72 C16.2 | C34.2 36.93,18.08 37.43,18.58 38.29,18.58 38.78,19.06
  Top 0.305: 13.77,16.41 P1.1 14.56,16.1 14.84,16.38 14.84,17.05 14.61,17.28 | 13.77,16.41 13.77,16.65 13.42,16.99 | C18.2 10.5,16.85 | C19.2 8.91,16.39 7.99,16.39 | C19.2 8.92,17.24 | C19.2 9.6,16.38 9.67,16.31 | C19.2 | 13.08,16.25 13.61,16.25 13.77,16.41 | P2.2 14.23,26.97 | C27.2 18.29,31.47 U3.2 | C25.1 33.44,35.88 35.68,35.88 35.9,36.1 RST.1 35.9,38.52 35.7,38.72 32.65,38.72 | 32.63,39.89 32.63,38.74 | C24.2 25.65,41.01 v25.68,41.04 | v31.53,40.34 32.17,40.34 BOOT.1 | D2.2 v27.01,40.27 v27.01,39.63 | C4.2 28.44,39.63 v29.05,40.24 29.48,39.81 29.48,39.2 C3.2 | v38.75,22.01 U7.7 38.75,23.43 38.6,23.57 38.6,25.63 37.83,26.4 36.81,26.4 36.09,25.69 C32.1 | U7.3 40.75,21.99 40.81,21.93 40.81,21.24 40.25,20.69 U7.29 | 40.25,19.31 U7.18 40.25,17.4 39.79,16.95 v39.79,16.54 | v40.15,15.12 40.15,14.64 40.7,14.08 C30.1 C31.1 | C1.2 27.26,22.4 | C42.2 13.67,4.61 | R45.1 | D6.1 18.52,4.23 | M2.2 21.51,2.2 | U7.13 37.26,19.51 36.94,19.82 R22.1 | D7.1 13.05,42.64 | D4.1 35.97,32.61 35.42,33.16 C40.2 | U7.29 39.25,19.51 38.88,19.51 | v38.85,19.14 38.88,19.14 U7.29 | U7.29 38.8,19.06 38.78,19.06 | R47.1 7.91,42.15 7.32,41.55 v6.59,41.55 | v17.87,35.24 18.34,35.24 18.54,35.04 18.68,35.04 C9.2
  Top 0.508: C43.2 3.9,39.79 v4.05,39.94 | M1.P$3 M1.P$2
  Top 0.61: 16.24,19.01 17.36,19.01 | 14.21,24.69 v14.23,24.71 | U2.4 14.9,36.51 14.72,36.69 14.72,40.75 14.29,41.18 14.29,42.05 v14.24,42.05 | USB.1 v20.49,42.15 | M1.P$2 M1.P$1 36.25,13.14 v37.58,13.14 | M1.P$2 36.23,12.79 | 36.23,12.79 | M1.P$2 36.32,13.73 37.4,13.73
  Top 0.813: J1.2 6.46,19.07 | J1.2 4.75,17.45 4.72,17.49 | J1.2 6.46,16.13 6.42,16.09 | J1.2 8.19,17.45 8.19,17.46 | 19.21,16.69 19.39,16.51 | v14.23,24.71 P2.2 | v14.26,21.07 14.26,20.99 16.24,19.01 | v14.21,23.91 14.21,24.69 | U3.8 13.37,30.46 14.24,29.6 14.24,28.56 14.21,28.53 14.11,28.63 14.11,29.42 15.94,31.25 | U3.2 16.42,31.73 15.94,31.25 | 15.94,31.25 15.94,32.3 15.85,32.39 U2.4
  Top 1.016: C22.2 19.82,16.06 19.27,16.61 | 18.38,19.01 19.21,18.18 19.21,17.97 19.27,17.97 19.27,17.88 | 19.27,17.88 19.27,16.64 | 19.27,17.88 C21.2
  Top 1.27: 18.38,19.01 17.36,19.01 16.34,19.01 14.61,17.28
  Bottom 0.203: v45.56,17.97 45.56,23.2 v45.43,23.33 45.48,23.38 45.48,26.4 48.2,29.12 v48.3,29.12 | v24.61,28.01 24.64,28.04 24.64,28.06 24.52,28.18 v24.52,29.47 | v19.44,25.05 17.92,25.05 v17.77,24.9 | v19.47,24.11 17.84,24.11 v17.79,24.16 | v19.67,23.3 17.95,23.3 v17.82,23.43
  Bottom 0.305: v25.68,41.04 26.83,41.04 27.01,40.85 v27.01,40.27 27.01,40.78 27.6,41.36 27.6,41.56 27.96,41.92 29.68,41.92 31.4,40.2 v31.53,40.34 29.15,40.34 v29.05,40.24 | v20.49,42.15 20.52,42.15 21.35,42.98 | v14.24,42.05 12.73,42.05 | v39.79,16.54 40.12,16.21 40.12,15.15 v40.15,15.12 | ENDSTOP.1 14.16,24.77 v14.23,24.71 | v6.59,41.55 7.79,41.55 10.22,43.98 13.05,43.98
  Bottom 0.508: v4.05,39.94 5.66,41.55 v6.59,41.55
  Bottom 0.61: v20.49,42.15 20.38,42.05 v14.24,42.05
  Bottom 0.813: v14.23,24.71 14.23,22.09 14.26,22.06 v14.26,21.07 14.26,20.99 v14.75,20.51
  other vias: 12.52,18.59 13.45,18.05 11.5,18.7 7.96,18.75 25.54,31.71 24.55,31.68 26.66,31.71 24.55,30.54 25.59,30.51 26.63,30.57 25.69,29.42 26.68,29.45 41.64,19.14 41.67,22.01 40.73,21.98 39.66,22.01 38.8,21.09 39.71,21.09 40.7,21.07 41.64,21.09 38.8,20.15 39.74,20.08 40.73,20.08 41.64,20.05 39.66,19.14 40.76,19.14 27.7,29.93 27.72,30.74 27.72,31.53 17.77,28.94 17.84,28.05 38.01,13.85 38.88,13.85 38.49,13.14 39.46,13.17 39.97,12.18 39.82,10.07 41.31,8.04 43.17,9.71 40.43,8.95 3.87,8.19 4.92,5.65 46.98,13.67 49.62,13.09 49.09,12.61 52.97,14.51 51.8,14.03 36.01,29.17 37.63,29.91 37.02,29.07 44.69,35.7 51.22,31.56 51.17,30.08 49.19,10.45 49.37,8.01 50.05,1.71 47.33,6.21 51.47,6.99 1.89,7.96 4.31,45.78 2.12,45.4 1.66,42.3 5.04,47.66 10.53,47.79 12.89,45.17 13.53,41.61 14.42,37.32 13.58,37.37 14.29,31.89 14.26,30.92 15.51,31.84 15.51,31.02 10.88,29.25 10.86,30.44 9.69,35.09 9.69,36.97 8.14,34.83 8.85,35.9 31.99,42.96 34.96,44.05 37.07,42.5 19.04,39.74 19.5,39 20.28,38.64 17.46,36.33 16.8,35.26 49.92,28.08 47.66,28.08 51.8,33.16 49.21,32.9 49.67,35.75 47.33,35.8 45.73,28.08 42.28,28.36 39.64,30.21 37.99,26.98 36.06,26.98 36.95,26.93 32.14,19.44 31.08,18.12 30.87,19.19 33.64,21.52 31.84,23.73 32.7,21.12 23.94,19.06 23.94,18.02 24.96,21.27 18.63,19.06 19.11,16.57 14.87,17.38 3.32,47.08 2.1,11.54 25.16,47.66 30.72,47.36 51.7,26.02 50.13,23.2 50.46,18.5 50.38,20.53 52.54,28.03 47.21,14.92 50.15,26.02 36.67,23.99 38.55,23.78 38.7,25.61 1.59,27.8 1.54,20.89 1.79,34.17 1.49,35.98 2.93,9.74 4.79,18.75 4.61,16.09 24.35,1.38 26.35,1.36 1.46,22.64 1.41,24.65 5.12,27.21 6.69,27.24 8.07,27.49 35.68,33.46 36.82,35.93 35.52,34.73 34.99,32.45 42.13,35.85 27.27,24.37 24.96,20.41 26.73,23.81 26.56,24.55 21.96,19.21 22.67,18.07 24.98,21.93 15.84,35.42 42.41,11.24 43.42,11.69 47.18,10.68 13.68,1.18 42.63,1.79 17.16,19.8 21.02,40.32 17.49,9.89 19.77,10.02 20.05,12.02 16.32,12.05 20.64,8.75 31.59,7.58 29.86,7.63 28.36,7.66 30.06,11.01 31.15,9.81 32.68,9.92 32.78,17.18 33.64,17.69
  pour Top: 13.27,15.68 14.98,15.68 15.08,15.77 15.08,17.89 13.47,19.5 3.99,19.5 3.32,18.82 3.32,16.24 3.89,15.67 11.05,15.67 11.5,16.12 11.5,16.19 12.76,16.19
  pour Top: 13.69,28.94 13.69,27.83 13.51,27.65 13.22,27.65 13.22,26.89 13.37,26.74 13.68,26.74 13.84,26.57 13.84,25.97 14.65,25.97 14.66,25.98 14.66,26.5 14.65,26.51 14.65,26.52 14.87,26.74 15.46,26.74 15.54,26.83 15.54,27.68 14.86,27.68 14.83,27.65 14.71,27.78 14.71,28.96 13.7,28.96 13.69,28.95
  pour Bottom: 26.76,40.6 27.29,40.6 27.37,40.52 27.37,39.35 27.27,39.25 26.84,39.25 26.68,39.41 26.68,40.52
  pour Top (rank 3): -0.57,49.62 -0.57,-0.68 54.27,-0.68 54.27,49.62
  pour Bottom (rank 3): -0.6,49.64 54.37,49.64 54.37,-0.88 -0.6,-0.88
GPIOLED
  Top 0.305: R28.1 28.24,45.47 D9.A
HE0  (via drill 0.35)
  Top 0.203: U6.2 46.16,11.79 R37.2 49.57,11.79 50.84,13.07 HE0.P$1 | U1.31 30.66,28.75 33.24,26.18 33.24,24.44 33.8,23.88 33.8,23.81 34.63,22.97 34.7,22.97 34.75,22.93 34.75,21.47 34.35,21.07 v34.35,17.08
  Top 0.305: U6.2 45.4,11.67 44.56,12.51 44.56,13.67 43.75,14.49 v43.37,14.49
  Bottom 0.203: v34.35,17.08 34.35,17.03 36.9,14.49 v43.37,14.49
HE0_PWR  (via drill 0.35)
  Top 0.406: M1.P$6 32.22,14.46 | M1.P$7 32.07,13.81 | 32.19,13.16 M1.P$8 33.08,13.6 M1.P$7 | M1.P$5 32.02,15.11 31.66,15.46 | 33.08,12.79 33.08,12.73 | 33.08,14.18 M1.P$7
  Top 0.508: M1.P$9 34.56,14.26 34.56,14.97 34.42,15.11 M1.P$5 | M1.P$9 34.36,14.46 M1.P$6 | M1.P$9 34.31,13.81 M1.P$7 | M1.P$9 33.66,13.16 M1.P$8 | 31.66,15.46 28.5,15.46 J3.1
  Top 0.61: J3.1 28.46,15.5 28.46,16.44 | J3.1 28.49,14.21 | J3.1 27.6,15.48 27.61,15.46 28.5,15.46 | 33.08,14.18 M1.P$6 M1.P$5 33.08,15.88 | 33.08,14.18 33.08,13.6 | M1.P$7 M1.P$8 | M1.P$8 | M1.P$8 33.08,12.79 | 33.08,14.18 34.63,14.18 M1.P$9 34.66,12.79 35.4,13.53 35.4,15.12 34.61,15.91
  Bottom 0.61: J3.1 28.49,16.39 28.54,16.44 | J3.1 30.01,15.48 30.11,15.38 | J3.1 28.49,14.16 28.51,14.13
  other vias: 30.85,13.22 29.58,13.65 30.87,14.34 30.62,15.58
  pour Top: 27.27,16.6 27.27,14.69 29.68,12.28 35.68,12.28 35.68,15.86 34.86,16.67 27.34,16.67
  pour Bottom: 27.32,16.65 27.32,14.72 29.71,12.33 35.55,12.33 35.8,12.58 31.69,16.7 27.37,16.7
HE0A
  Top 0.203: 43.03,13.09 U6.4 | R31.2 42.48,13.07
  Top 0.305: R31.2 43.03,13.09 | 42.48,13.07 R30.2
HE0B
  Top 0.203: M1.P$4 37.01,15.11 37.07,15.05 37.07,14.82 37.23,14.67 39.36,14.67 41.03,12.99 41.49,12.99 R31.1
LDOLED
  Top 0.305: R15.1 9.5,25.49 D3.A
LED  (via drill 0.35)
  Top 0.305: v24.91,46.75 24.93,46.77 29.75,46.77 30.66,45.86 30.66,45.75 R28.2 30.94,44.85 30.26,44.18 26.4,44.18 25.9,43.67 v25.64,43.67 | U1.4 20.86,31.95 v20.64,31.73
  Bottom 0.305: v20.64,31.73 20.46,31.91 20.46,33.35 22.59,35.49 22.59,39.63 23.48,40.52 23.89,40.52 25.44,42.07 25.44,43.39 25.68,43.63 v25.64,43.67
N$1
  Top 0.61: M2.3 20.56,7.07 19.55,8.09 H_FAN.2
N$3
  Top 0.61: M3.3 3.3,40.75 2.83,40.75 2.42,40.34 2.42,38.96 2.4,38.94 2.4,36.38 3.19,35.59 4.92,35.59 6.41,37.09 M_FAN.2
N$4
  Top 0.61: C_FAN.2 10.68,9.38 12.15,10.86 21.81,10.86 24.07,8.59 32.85,8.59 34.89,10.63 36.97,10.63 37.07,10.63 38.62,9.08 C_FAN2.2 40.2,6.33 M4.3
OSC_IN
  Top 0.203: C1.1 26.27,20.9 X1.P$1 28.23,21.55 arc101 28.21,23.56 arc-99 R4.2 27.42,25.05 arc-37 25.49,25.72 arc-53 25.01,26.7 U1.20
OSC_OUT
  Top 0.203: R3.2 R4.1 R4.1 arc105 28.03,25.77 arc-42 25.95,25.87 arc-66 25.41,26.68 U1.21
QSPI_SCK
  Top 0.203: U1.52 24.61,35.23 23.9,35.94 23.9,36.86 23.75,37 23.42,37 23.04,37.38 U2.6
QSPI_SD0
  Top 0.203: U1.53 24.21,34.8 23.04,35.98 U2.5
QSPI_SD1  (via drill 0.35)
  Top 0.203: v18.48,38.47 17.98,38.97 15.93,38.97 U2.2 | v20.18,36.96 20.75,36.96 23.42,34.3 U1.55
  Bottom 0.203: v20.18,36.96 20.11,36.96 18.61,38.47 v18.48,38.47
QSPI_SD2
  Top 0.203: U1.54 23.81,34.5 20.54,37.78 U2.3
QSPI_SD3
  Top 0.203: U1.51 25.01,35.43 24.28,36.16 24.28,37.04 23.9,37.41 23.9,38.13 23.75,38.27 23.5,38.27 23.04,38.73 U2.7
QSPI_SS  (via drill 0.35)
  Top 0.203: U1.56 23,33.9 | 23,33.9 22.18,33.9 19.32,36.76 v19.29,36.76 | v17.36,39.96 16.2,39.96 U2.1 | R12.1 30.39,39.61 | 30.39,39.61 R13.1 | 30.39,39.61 30.93,39.61 v31.13,39.4 | v22.48,34.45 22.48,34.43 23,33.92 23,33.9
  Bottom 0.203: v19.29,36.76 18.5,36.76 17.36,37.91 v17.36,39.96 | v31.13,39.4 28.21,36.49 26.02,36.49 25.52,36.99 25.01,36.99 24.68,36.66 24.68,36.64 v22.48,34.45
RESET  (via drill 0.35)
  Top 0.203: 31.75,36.23 C25.2 31.24,34.78 v30.95,34.78 | RST.2 32.4,36.48 | 31.75,36.23 32.35,36.23 32.55,36.44 32.55,36.64 32.4,36.48 | 31.75,36.23 31.68,36.23 31.45,36.46 R14.1 32.37,36.46 32.4,36.48 | v27.42,28.05 27.42,27.21 U1.26
  Bottom 0.203: v30.95,34.78 29.48,33.31 29.48,28.79 28.79,28.1 27.47,28.1 v27.42,28.05
SPI1_CS  (via drill 0.35)
  Top 0.203: R19.1 23.1,20.46 22.41,21.15 22.41,21.16 U5.7 v22.14,22.54 | v23.43,28.03 23.43,27.22 U1.16
  Bottom 0.203: v22.14,22.54 22.39,22.79 22.39,26.45 21.86,26.98 21.86,27.44 22.44,28.02 v23.43,28.02 v23.43,28.03
SPI1_MISO  (via drill 0.35)
  Top 0.203: R18.1 24.04,24.44 24.04,24.65 | 24.04,24.65 23.96,24.73 U5.12 | 24.04,24.65 24.09,24.6 24.09,24.5 24.55,24.04 v24.55,23.12 | v22.47,27.19 22.48,27.2 U1.15
  Bottom 0.203: v24.55,23.12 23.69,23.12 23.13,23.68 23.13,26.53 v22.47,27.19
SPI1_MOSI
  Top 0.203: 24.27,25.69 23.39,25.69 U5.13 | 24.27,25.69 24.4,25.69 24.62,25.46 R17.1 | U1.18 24.21,25.75 24.27,25.69
SPI1_SCK
  Top 0.203: 22.19,25.68 22.41,25.9 22.41,25.91 22.56,26.06 23.71,26.06 23.81,26.16 U1.17 | 22.19,25.68 U5.14 | R20.1 21.91,26.65 22.04,26.53 22.04,25.84 22.19,25.68
STEP
  Top 0.305: R24.2 39.25,17.02 U7.16
SWB
  Top 0.203: R12.2 30.72,41.36 33.73,41.36 33.77,41.4 35.53,41.4 35.9,41.03 BOOT.2
TH0  (via drill 0.35)
  Top 0.203: U1.38 30.69,31.55 v30.85,31.4 | TH0.P$1 41.72,35.04 40.86,35.9 38.57,35.9 v38.52,35.95
  Top 0.305: R36.2 33.16,34.17 32.4,34.17 32.3,34.07 v32.3,33.72 32.3,33.26 32.42,33.13 33.27,33.13 C40.1
  Bottom 0.203: v38.52,35.95 37.94,35.37 33.16,35.37 32.27,34.48 32.27,33.74 v32.3,33.72
  Bottom 0.305: v30.85,31.4 32.3,32.84 v32.3,33.72
TH0A  (via drill 0.35)
  Top 0.305: R34.1 R35.1 R33.1
  Top 0.508: R33.1 39.99,32.62 39.71,32.34 v39.71,31.4
  Bottom 0.305: 39.71,31.36 v39.71,31.4
  Bottom 0.508: J3.4 25.49,19.32 34.48,28.31 34.48,29.2 36.64,31.36 39.71,31.36
TH0B
  Top 0.305: R36.1 34.09,34.1 D4.3 37,34.03 39.07,34.03 R35.2
TH0C
  Top 0.305: SJ2.1 37.88,35.63 38.6,34.91 39.05,34.91 R34.2
TMC5V
  Top 0.305: 37.82,22.09 U7.8
  Top 0.61: C32.2 37.64,22.27 37.82,22.09
TMCCPI
  Top 0.305: C28.1 39.75,24.54 U7.5
TMCCPO
  Top 0.305: C28.2 41,24.58 40.25,23.83 U7.4
TMCENN  (via drill 0.35)
  Top 0.305: R23.1 R21.2 40.98,26.98 v42.08,26.98 | v42.2,24.74 42.2,24.33 41.25,23.37 U7.2
  Bottom 0.305: v42.08,26.98 42.08,24.74 v42.2,24.74
TMCVCP
  Top 0.305: C29.2 39.8,25.79 39.15,25.14 39.15,23.71 39.25,23.62 U7.6
USB1_N  (via drill 0.35)
  Top 0.203: 18.14,43.85 18.14,44.07 v18.56,44.48
  Top 0.305: R11.1 27.7,39.05 27.7,40.55 27.51,40.73 D2.3 D2.4 27.51,42.76 27.62,42.86 27.62,43.36 27.51,43.47 27.51,43.68 27.47,43.72 26.61,43.72 24.8,41.92 22.54,41.92 22.16,41.54 18.81,41.54 18.14,42.21 USB.5 18.14,43.85 18.14,44.12 17.95,44.31 17.36,44.31 17.14,44.08 USB.7
  Bottom 0.203: v18.56,44.48 18.56,45.02 IO1.P$1
USB1_P  (via drill 0.35)
  Top 0.203: USB.8 16.64,44.05 v16.5,44.18
  Top 0.305: R10.1 26.35,38.82 26.35,40.57 26.51,40.73 D2.1 D2.6 25.93,42.35 25.04,41.46 22.73,41.46 22.35,41.08 22.24,41.08 22.21,41.06 18.65,41.06 17.71,41.99 | USB.6 17.64,42.06 17.71,41.99 | USB.8 16.64,41.86 16.93,41.56 17.29,41.56 17.71,41.99
  Bottom 0.203: v16.5,44.18 14.82,45.86 IO2.P$1
USB_N
  Top 0.203: U1.46 27.01,37.5 R11.2
USB_P
  Top 0.203: U1.47 26.61,37.07 26.61,37.7 R10.2
VBUS
  Top 0.508: USB.2 19.74,43.81 19.42,44.13 19.42,44.82 19.93,45.32 | 19.93,45.32 21.96,45.32 SJ3.2 | 19.93,45.32 16.62,45.32 15.04,43.74 USB.11
VBUS1  (via drill 0.35)
  Top 0.305: v26.99,44.79 26.33,44.79 26.01,44.47 24.02,44.47 F1.2 | v27.01,43.11 D2.5
  Top 0.508: SJ3.1 23.89,45.4 23.15,44.66 F1.2
  Bottom 0.203: v26.99,44.79 27.01,44.76
  Bottom 0.305: 27.01,44.76 v27.01,43.11
VBUS3  (via drill 0.35)
  Top 0.508: 13.75,38.92 D1.2
  Top 0.61: F1.1 24.81,43.57 24.81,43.5 v23.89,42.58 | v13.73,40.12 13.75,40.09 13.75,38.92
  Bottom 0.61: v23.89,42.58 23.15,42.58 21.7,41.13 14.74,41.13 v13.73,40.12
VRC
  Top 0.152: C23.1 18.66,14.01 R8.2 18.66,13.6 R7.1
VREGEN  (via drill 0.35)
  Top 0.254: v12.6,17.1 12.28,17.42 R6.2 | v15.25,15.1 15.54,15.1 15.59,15.15 P1.5 | R5.1 12.48,12.97 v12.65,13.14
  Bottom 0.254: v12.6,17.1 14,15.7 14,15.1 | 14,15.1 v15.25,15.1 | v12.65,13.14 14,14.49 14,15.1
VREGFB
  Top 0.152: C23.2 16.81,13.85 P1.4 17.15,14.2 17.48,14.52 R8.1 R9.2
VREGO  (via drill 0.35)
  Top 0.152: 17.83,16.96 C20.2
  Top 0.305: 13.26,15.15 P1.2 13.57,14.95
  Top 0.61: 13.26,15.15 13.07,15.34 13.57,15.34 | 13.57,14.95 13.07,14.95 12.9,14.78 v12.71,14.78 | C20.2 17.85,17.05 v17.85,17.77
  Top 0.813: U$1.1 10.32,21.75 v9.97,22.09 9.18,22.09 v9.17,22.1 v9.17,21.31
  Top 1.016: v11.9,15.59 v11.9,15.58 12.61,15.58 12.61,14.8 v11.91,14.8
  Bottom 1.016: v17.85,17.77 17.04,18.58 15.14,18.58 11.76,21.96 11.76,22.78 11.47,23.07 9.69,23.07 9.17,22.56 v9.17,21.31
  other vias: 12.67,15.58
  pour Bottom: 13.25,15.83 13.25,14.46 12.97,14.18 9.09,14.18 8.64,14.64 8.64,22.53 8.92,22.82 10.32,22.82 10.66,22.48 10.66,16.67 11.3,16.03 13.05,16.03
  pour Top: 12.42,22.7 8.91,22.7 8.72,22.51 8.72,20.97 8.98,20.71 12.52,20.71 12.52,22.64 12.45,22.71
XR
  Top 0.203: R3.1 30.24,23.33 arc-85 X1.P$3 30.2,22.07 31.36,22.07 C2.2

## Text on the board
tNames: + | - | TH0 | CAN_H | CAN_L | - | B2 | Ax | B1 | +3.3V | + | Ay | Az | A1 | GND | +5V | A2 | GND | +24 | Dragon ToolBoard V2 | +24V | HE0
bNames: DP | DN | GND | POWER | +24V | + | - | + | - | - | +